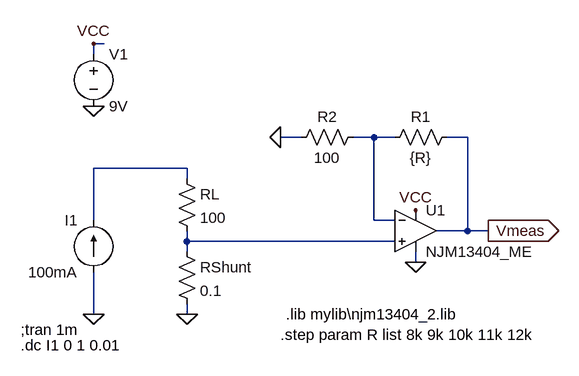
[diagram p0: schematic Ammeter.asc]
Ammeter.asc, the LTspice schematic file:
Version 4
SHEET 1 880 680
WIRE 16 -352 0 -352
WIRE 0 -336 0 -352
WIRE 320 -208 288 -208
WIRE 432 -208 400 -208
WIRE 464 -208 432 -208
WIRE 576 -208 544 -208
WIRE 144 -160 0 -160
WIRE 144 -144 144 -160
WIRE 0 -80 0 -160
WIRE 432 -80 432 -208
WIRE 464 -80 432 -80
WIRE 576 -64 576 -208
WIRE 576 -64 528 -64
WIRE 608 -64 576 -64
WIRE 144 -48 144 -64
WIRE 464 -48 144 -48
WIRE 144 -32 144 -48
WIRE 496 -16 496 -32
WIRE 0 64 0 0
WIRE 144 64 144 48
FLAG 144 64 0
FLAG 0 64 0
FLAG 608 -64 Vmeas
IOPIN 608 -64 Out
FLAG 496 -96 VCC
FLAG 0 -256 0
FLAG 0 -352 VCC
FLAG 496 -16 0
FLAG 288 -208 0
SYMBOL current 0 0 R180
WINDOW 0 24 80 Left 2
WINDOW 3 24 0 Left 2
WINDOW 123 0 0 Left 2
WINDOW 39 0 0 Left 2
SYMATTR InstName I1
SYMATTR Value 100mA
SYMBOL res 128 -160 R0
SYMATTR InstName RL
SYMATTR Value 100
SYMBOL res 128 -48 R0
SYMATTR InstName RShunt
SYMATTR Value 0.1
SYMBOL Opamps\\opamp2 496 -128 R0
SYMATTR InstName U1
SYMATTR Value NJM13404_ME
SYMBOL voltage 0 -352 R0
WINDOW 123 0 0 Left 2
WINDOW 39 0 0 Left 2
SYMATTR InstName V1
SYMATTR Value 9V
SYMBOL res 560 -224 R90
WINDOW 0 0 56 VBottom 2
WINDOW 3 32 56 VTop 2
SYMATTR InstName R1
SYMATTR Value {R}
SYMBOL res 416 -224 R90
WINDOW 0 0 56 VBottom 2
WINDOW 3 32 56 VTop 2
SYMATTR InstName R2
SYMATTR Value 100
TEXT -112 88 Left 2 !;tran 1m
TEXT 296 64 Left 2 !.lib mylib\\njm13404_2.lib
TEXT -112 112 Left 2 !.dc I1 0 1 0.01
TEXT 288 96 Left 2 !.step param R list 8k 9k 10k 11k 12k

The netlist it stands for:
* Ammeter.asc
I1 0 N002 100mA
RL N002 N003 100
RShunt N003 0 0.1
XU1 N003 N001 VCC 0 Vmeas NJM13404_ME  ; pins In+ In- V+ V- OUT
V1 VCC 0 9V
R1 Vmeas N001 {R}
R2 N001 0 100
;tran 1m
.lib mylib\njm13404_2.lib
.dc I1 0 1 0.01
.step param R list 8k 9k 10k 11k 12k
.backanno
.end